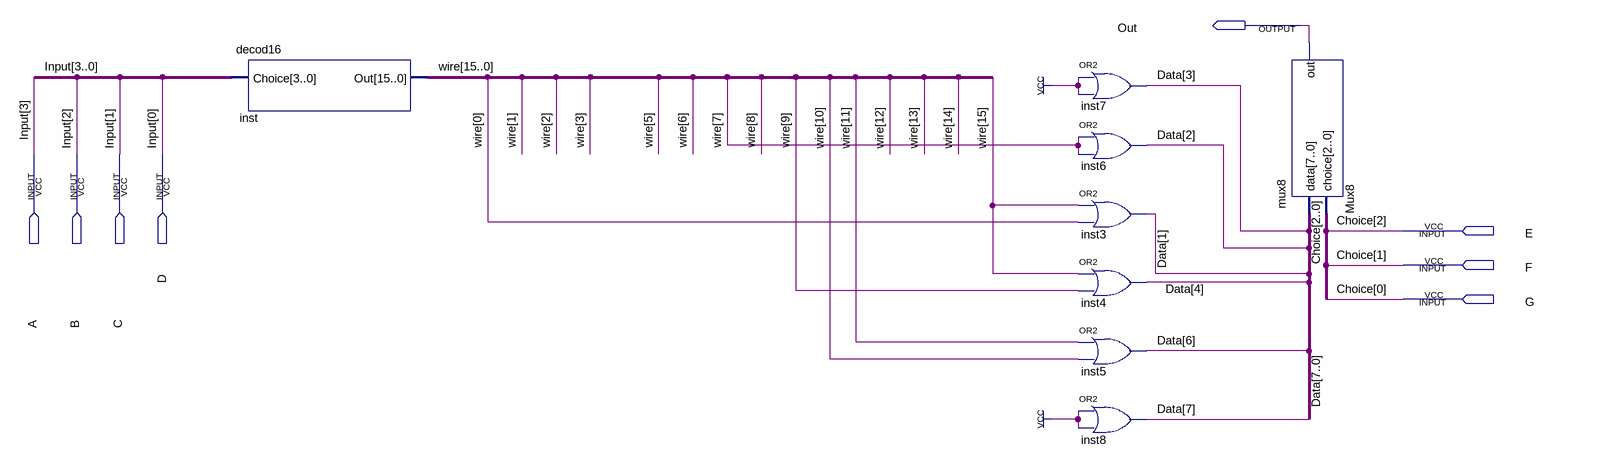
[diagram p0: schematic sheet]
// Quartus schematic topic__2_3.bdf as structural Verilog: 8 symbols, 8 pins
module topic__2_3 (
  input  A,
  input  B,
  input  C,
  input  D,
  input  E,
  input  F,
  input  G,
  output Out
);

  wire [7:0] Data;
  wire [15:0] \wire ;

  decod16 inst (.Choice({A, B, C, D}), .Out(\wire ));
  or inst7 (Data[3], 1'b1, 1'b1);
  or inst6 (Data[2], \wire [7], \wire [7]);
  or inst3 (Data[1], \wire [15], \wire [0]);
  or inst4 (Data[4], \wire [15], \wire [9]);
  or inst5 (Data[6], \wire [11], \wire [10]);
  or inst8 (Data[7], 1'b1, 1'b1);
  mux8 Mux8 (.data(Data), .choice({E, F, G}), .out(Out));

  // Other names for the same wires on the sheet: Choice[2:0] = {E, F, G}; Input[3:0] = {A, B, C, D}
endmodule
